# Altium schematic sheet Prototype V1.SchDoc
size A4; SheetNumber: 1; SheetTotal: 1
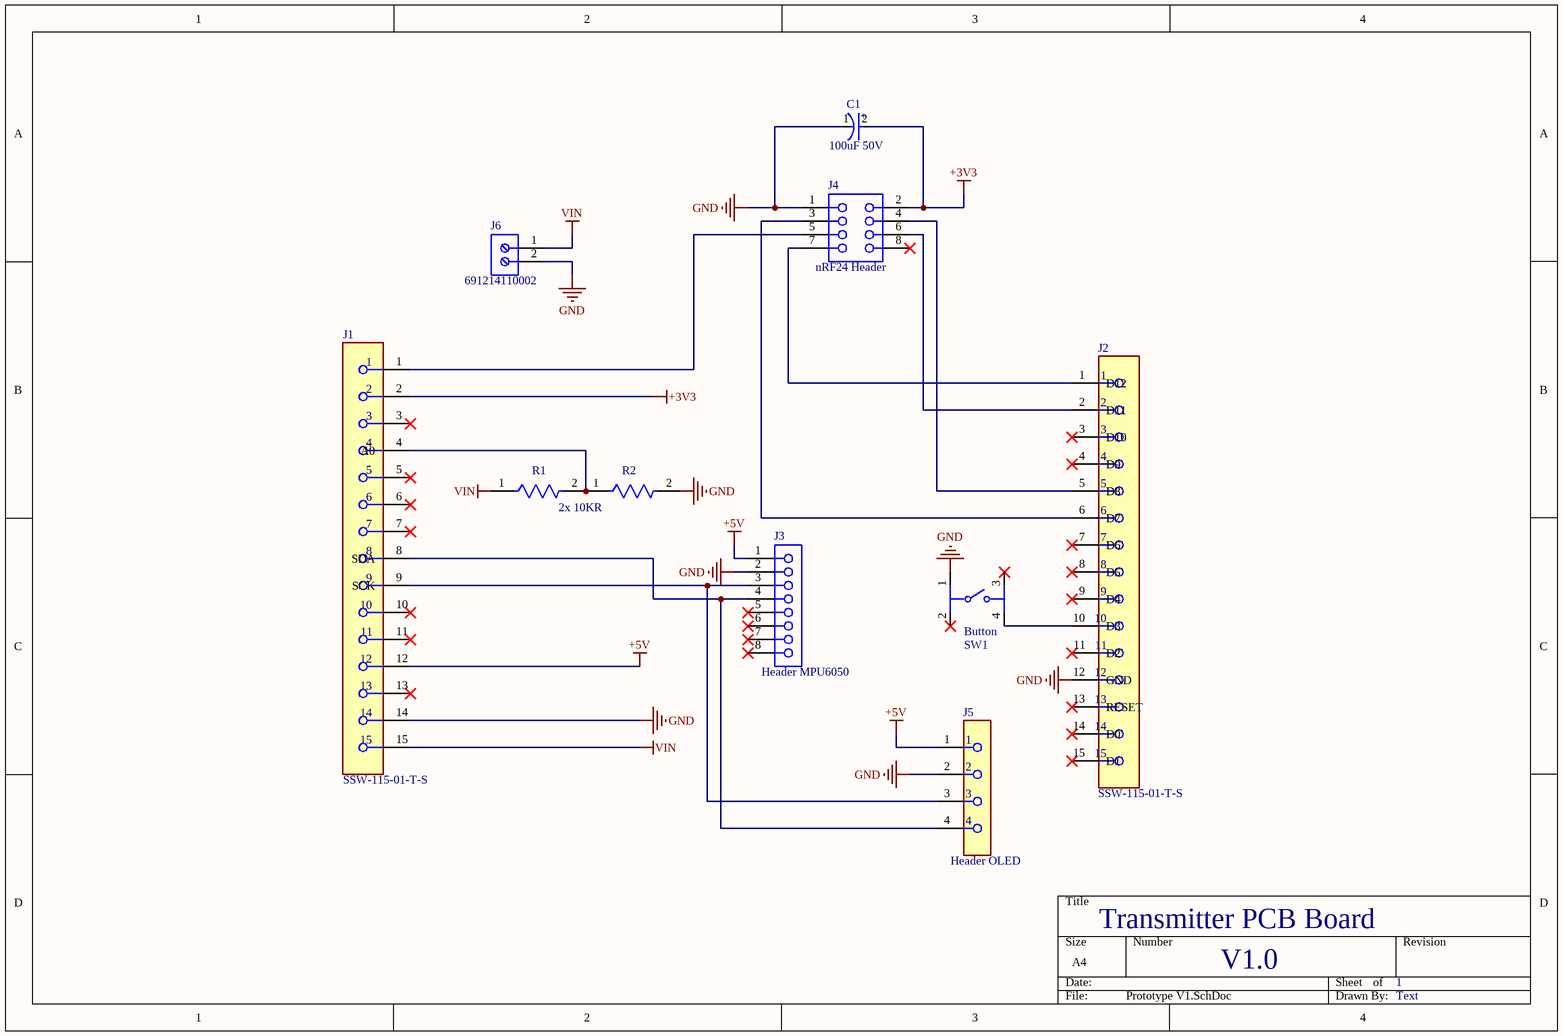
[diagram p0: Prototype V1.SchDoc]

## Parts
C1  100uF 50V  [FP-EEU-FR1H101B-MFG]
J1  SSW-115-01-T-S  [FP-SSW-115-01-T-S-MFG]
J2  SSW-115-01-T-S  [FP-SSW-115-01-T-S-MFG]
J3  Header MPU6050  [61300811821]
J4  nRF24 Header  [61300821821]
J5  Header OLED  [FP-SSW-104-02-G-S-MFG]
J6  691214110002  [691214110002]
R1  (no value)  [FP-ZOR-25-R-52-0R-MFG]
R2  2x 10KR  [FP-ZOR-25-R-52-0R-MFG]
SW1  Button  [FP-2-1825910-7-MFG]

## Nets
+3V3: C1.2(A) J1.2 J4.2
+5V: J1.12 J3.1 J5.1
GND: C1.1(C) J1.14 J2.12(GND) J3.2 J4.1 J5.2 J6.2 R2.2 SW1.1
VIN: J1.15 J6.1 R1.1
NetJ1_1: J1.1 J4.5
NetJ1_4: J1.4(A0) R1.2 R2.1
NetJ1_8: J1.8(SDA) J3.4 J5.4
NetJ1_9: J1.9(SCK) J3.3 J5.3
NetJ2_1: J2.1(D12) J4.7
NetJ2_2: J2.2(D11) J4.6
NetJ2_5: J2.5(D8) J4.4
NetJ2_6: J2.6(D7) J4.3
NetJ2_10: J2.10(D3) SW1.4

Not connected (* = marked no-connect by the designer): J1 3* 5* 6* 7* 10* 11* 13*; J2 3(D10)* 4(D9)* 7(D6)* 8(D5)* 9(D4)* 11(D2)* 13(RESET)* 14(D0)* 15(D1)*; J3 5* 6* 7* 8*; J4 8*; SW1 2* 3*

## Notes on the sheet
- Transmitter PCB Board
- V1.0
- 1
- Text
- (in symbol CMP-05427-000020-1) +

## Library data of the parts
C1 = CMP-05427-000020-1: CAP ALUM 100UF 20% 50V RADIAL; Life (Hours): 6000Hour; Ripple Current: 870mA; Lead Diameter: 0.6mm; Impedance: 61mR; Tolerance: 20%; Mount: Through Hole; Lead Free: Lead Free; Length: 11.5mm; Height - Seated (Max): 0.512inch; Contact Plating: Tin; Termination: Radial; Series: FR; Max Operating Temperature: 105°C; Features: General Purpose; Min Operating Temperature: -40°C; RoHS Compliant: Yes; Height: 11.5mm; Voltage Rating (DC): 50V; Diameter: 8mm; Capacitance: 100uF; Lead Pitch: 5mm; Radiation Hardening: No; Package Quantity: 1; Case/Package: Radial; Voltage Rating: 50V; Packaging: Tape and Reel; ESR (Equivalent Series Resistance): 61mR; REACH SVHC: No SVHC
J1 J2 = CMP-02766-001723-1: CONN RCPT 15POS 0.1 TIN PCB; Connector Type: Receptacle; Max Voltage Rating (AC): 550V; Mating Cycles: 100; Number of Positions: 15; Pitch: 0.1inch; Max Current Rating: 6.9A; Contact Resistance: 10mR; Contact Type: Female Socket; Color: Black; Depth: 2.41mm; Radiation Hardening: No; Orientation: Straight; Termination: Solder; Series: SSW; Lead Free: Lead Free; Min Operating Temperature: -55°C; Contact Plating: Tin; Contact Material: Bronze; Max Operating Temperature: 105°C; Mount: Through Hole; Packaging: Bulk; Gender: Receptacle; Housing Material: Polymer; RoHS Compliant: Yes; Length: 38.61mm; Number of Rows: 1; REACH SVHC: No SVHC; Width: 2.41mm; Number of Contacts: 15; Housing Color: Black
J3 = CMP-1502-01327-3: NexarPartId: 61924723; Current Rating: 3A; Gender: Female; Contact Resistance: 20mΩ; Operating Supply Voltage: 250V; Lead Pitch: 2.54mm; RoHS: Non-Compliant; Orientation: Vertical; Number of Pins: 8
J4 = CMP-1502-01329-3: NexarPartId: 61924725; Operating Supply Voltage: 250V; Contact Resistance: 20mΩ; Gender: Female; Current Rating: 3A; RoHS: Non-Compliant; Lead Pitch: 2.54mm; Number of Pins: 8; Orientation: Vertical
J5 = CMP-00575-00296407-1: SSW-104-02-G-S Board to Board & Mezzanine Connectors Tiger Buy Socket Strip with PCB Tails, .100 Pitch; NexarPartId: 296407; Manufacturer Lifecycle Status: PRODUCTION; Gender: Receptacle; Pitch: 2.54mm; Number of Positions: 4; Contact Resistance: 10mΩ; Connector Type: Receptacle, Socket; Voltage Rating: 550V; Max Current Rating: 6.9A; Voltage Rating (DC): 655V; Voltage Rating (AC): 465V; Current Rating: 4.7A; RoHS: Compliant; Lead Pitch: 2.54mm; Min Operating Temperature: -55°C; Housing Material: Polymer; Length: 10.67mm; Mount: Through Hole; Orientation: Straight; Lifecycle Status: Production; Lead Free: Lead Free; REACH SVHC: No SVHC; Number of Rows: 1; Contact Plating: Gold; Radiation Hardening: No; Max Operating Temperature: 125°C; Housing Color: Black; Height: 8.64mm; Contact Material: Bronze, Gold, Nickel; Width: 2.41mm; Number of Contacts: 4; Packaging: Bulk; Termination: Solder; Depth: 2.41mm; Max Voltage Rating (AC): 550V; Color: Black
J6 = CMP-1502-02464-2: NexarPartId: 18818288; Plating: Brass, Steel; Current: 10A; Pitch: 3.5052mm; Number of Levels: 1; Number of Contacts: 2; Wire Gauge (Min): 16AWG; Voltage: 300V; Wire Gauge (Max): 24AWG; Stripping Length: -6mm; Number of Pins: 2; Number of Rows: 1; REACH SVHC: Unknown; RoHS: Compliant; Housing Material: Nylon; Termination: Screw; Mount: Through Hole; Contact Plating: Brass, Tin; Number of Positions Per Level: 2; Color: Blue, Green; Width: 7.9mm; Voltage Rating: 300V; Length: 7.4mm; Current Rating: 10A; Wire/Cable Gauge: 24AWG; Packaging: Box; Max Operating Temperature: 105°C; Lead Pitch: 3.5mm; Height: 8.7mm; Contact Material: Brass; Min Operating Temperature: -40°C
R1 R2 = CMP-03413-000010-1: RES 0 OHM JUMPER 1/4W AXIAL; Temperature Coefficient: 100ppm/°C; Max Power Dissipation: 250mW; Tolerance: 5%; Resistance: 0mR; Case/Package: Axial; Termination: Axial; Series: ZOR; Lead Free: Lead Free; Length: 0.248inch; Military Standard: Not; RoHS Compliant: Yes; Min Operating Temperature: -55°C; Packaging: Tape and Reel; Resistor Type: Carbon Film; Construction: Cylindrical; Package Quantity: 5000; Max Operating Temperature: 155°C; Number of Terminations: 2; Power Rating: 250mW
SW1 = CMP-03402-000004-1: SWITCH TACTILE SPST-NO 0.05A 24V; Manufacturer Part Number: 2-1825910-7; Manufacturer: TE Connectivity; Contact Current Rating: 50mA; Operating Force: 160gf; Electromechanical Life: 100000Cycles; Contact Resistance: 100mΩ; ComponentLink2Description: Datasheet; Height: 13.3mm; Digikey Description: SWITCH TACTILE SPST-NO 0.05A 24V; Device Class L2: Switches; Category: Switch; Device Class L3: Pushbutton Switches; Device Class L1: Electromechanical; Mount: Through Hole; Temperature Range High: +85°C; ComponentLink2URL: https://www.te.com/commerce/DocumentDelivery/DDEController?Action=showdoc&DocId=Customer+Drawing%7F1825910%7FC10%7Fpdf%7FEnglish%7FENG_CD_1825910_C10.pdf%7F2-1825910-7; RoHS: TRUE; Temperature: -35°C to +85°C; Mouser Description: Switch Tactile OFF (ON) SPST Extended Round Button PC Pins 0.05A 24VDC 100000Cycles 1.57N Thru-Hole Loose; Automotive: No; Voltage Rating Dc: 24V; Package: 2-1825910-7; Lead Free: Yes; Octopart: https://octopart.com/2-1825910-7-te+connectivity-42270510; Temperature Range Low: -35°C; Throw Configuration: SPST-NO